# EAGLE schematic 11-de-7 (EAGLE 6.6.0)
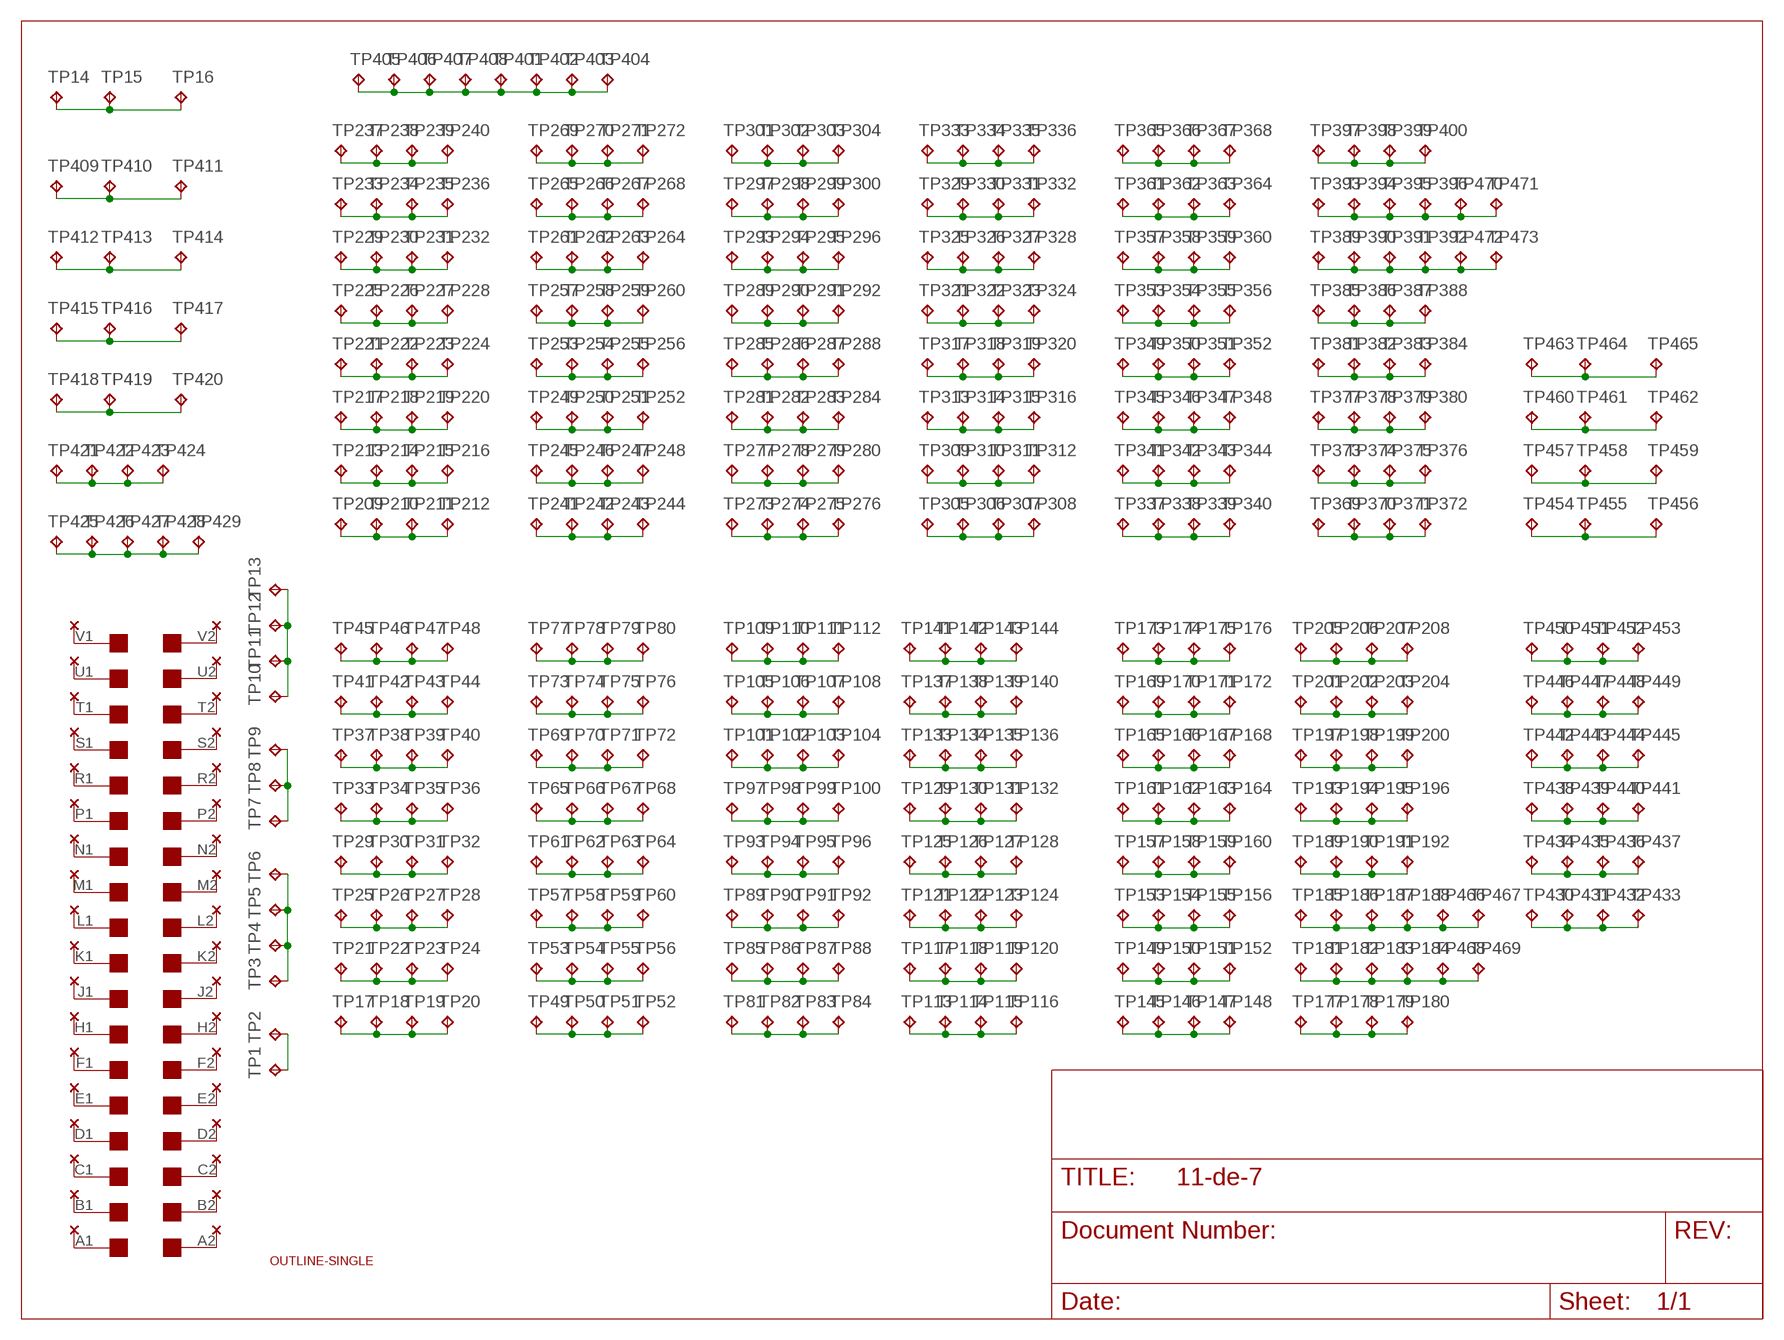
[diagram p0: schematic, sheet 1]

## Parts
TP1  TPPAD1-13Y  [P1-13Y]
TP2  TPPAD1-13  [P1-13]
TP3  TPPAD1-13Y  [P1-13Y]
TP4  TPPAD1-13Y  [P1-13Y]
TP5  TPPAD1-13Y  [P1-13Y]
TP6  TPPAD1-13Y  [P1-13Y]
TP7  TPPAD1-13Y  [P1-13Y]
TP8  TPPAD1-13Y  [P1-13Y]
TP9  TPPAD1-13Y  [P1-13Y]
TP10  TPPAD1-13Y  [P1-13Y]
TP11  TPPAD1-13Y  [P1-13Y]
TP12  TPPAD1-13Y  [P1-13Y]
TP13  TPPAD1-13Y  [P1-13Y]
TP14  TPPAD1-13Y  [P1-13Y]
TP15  TPPAD1-13Y  [P1-13Y]
TP16  TPPAD1-13Y  [P1-13Y]
TP17  TPPAD1-13Y  [P1-13Y]
TP18  TPPAD1-13Y  [P1-13Y]
TP19  TPPAD1-13Y  [P1-13Y]
TP20  TPPAD1-13Y  [P1-13Y]
TP21  TPPAD1-13Y  [P1-13Y]
TP22  TPPAD1-13Y  [P1-13Y]
TP23  TPPAD1-13Y  [P1-13Y]
TP24  TPPAD1-13Y  [P1-13Y]
TP25  TPPAD1-13Y  [P1-13Y]
TP26  TPPAD1-13Y  [P1-13Y]
TP27  TPPAD1-13Y  [P1-13Y]
TP28  TPPAD1-13Y  [P1-13Y]
TP29  TPPAD1-13Y  [P1-13Y]
TP30  TPPAD1-13Y  [P1-13Y]
TP31  TPPAD1-13Y  [P1-13Y]
TP32  TPPAD1-13Y  [P1-13Y]
TP33  TPPAD1-13Y  [P1-13Y]
TP34  TPPAD1-13Y  [P1-13Y]
TP35  TPPAD1-13Y  [P1-13Y]
TP36  TPPAD1-13Y  [P1-13Y]
TP37  TPPAD1-13Y  [P1-13Y]
TP38  TPPAD1-13Y  [P1-13Y]
TP39  TPPAD1-13Y  [P1-13Y]
TP40  TPPAD1-13Y  [P1-13Y]
TP41  TPPAD1-13Y  [P1-13Y]
TP42  TPPAD1-13Y  [P1-13Y]
TP43  TPPAD1-13Y  [P1-13Y]
TP44  TPPAD1-13Y  [P1-13Y]
TP45  TPPAD1-13Y  [P1-13Y]
TP46  TPPAD1-13Y  [P1-13Y]
TP47  TPPAD1-13Y  [P1-13Y]
TP48  TPPAD1-13Y  [P1-13Y]
TP49  TPPAD1-13Y  [P1-13Y]
TP50  TPPAD1-13Y  [P1-13Y]
TP51  TPPAD1-13Y  [P1-13Y]
TP52  TPPAD1-13Y  [P1-13Y]
TP53  TPPAD1-13Y  [P1-13Y]
TP54  TPPAD1-13Y  [P1-13Y]
TP55  TPPAD1-13Y  [P1-13Y]
TP56  TPPAD1-13Y  [P1-13Y]
TP57  TPPAD1-13Y  [P1-13Y]
TP58  TPPAD1-13Y  [P1-13Y]
TP59  TPPAD1-13Y  [P1-13Y]
TP60  TPPAD1-13Y  [P1-13Y]
TP61  TPPAD1-13Y  [P1-13Y]
TP62  TPPAD1-13Y  [P1-13Y]
TP63  TPPAD1-13Y  [P1-13Y]
TP64  TPPAD1-13Y  [P1-13Y]
TP65  TPPAD1-13Y  [P1-13Y]
TP66  TPPAD1-13Y  [P1-13Y]
TP67  TPPAD1-13Y  [P1-13Y]
TP68  TPPAD1-13Y  [P1-13Y]
TP69  TPPAD1-13Y  [P1-13Y]
TP70  TPPAD1-13Y  [P1-13Y]
TP71  TPPAD1-13Y  [P1-13Y]
TP72  TPPAD1-13Y  [P1-13Y]
TP73  TPPAD1-13Y  [P1-13Y]
TP74  TPPAD1-13Y  [P1-13Y]
TP75  TPPAD1-13Y  [P1-13Y]
TP76  TPPAD1-13Y  [P1-13Y]
TP77  TPPAD1-13Y  [P1-13Y]
TP78  TPPAD1-13Y  [P1-13Y]
TP79  TPPAD1-13Y  [P1-13Y]
TP80  TPPAD1-13Y  [P1-13Y]
TP81  TPPAD1-13Y  [P1-13Y]
TP82  TPPAD1-13Y  [P1-13Y]
TP83  TPPAD1-13Y  [P1-13Y]
TP84  TPPAD1-13Y  [P1-13Y]
TP85  TPPAD1-13Y  [P1-13Y]
TP86  TPPAD1-13Y  [P1-13Y]
TP87  TPPAD1-13Y  [P1-13Y]
TP88  TPPAD1-13Y  [P1-13Y]
TP89  TPPAD1-13Y  [P1-13Y]
TP90  TPPAD1-13Y  [P1-13Y]
TP91  TPPAD1-13Y  [P1-13Y]
TP92  TPPAD1-13Y  [P1-13Y]
TP93  TPPAD1-13Y  [P1-13Y]
TP94  TPPAD1-13Y  [P1-13Y]
TP95  TPPAD1-13Y  [P1-13Y]
TP96  TPPAD1-13Y  [P1-13Y]
TP97  TPPAD1-13Y  [P1-13Y]
TP98  TPPAD1-13Y  [P1-13Y]
TP99  TPPAD1-13Y  [P1-13Y]
TP100  TPPAD1-13Y  [P1-13Y]
TP101  TPPAD1-13Y  [P1-13Y]
TP102  TPPAD1-13Y  [P1-13Y]
TP103  TPPAD1-13Y  [P1-13Y]
TP104  TPPAD1-13Y  [P1-13Y]
TP105  TPPAD1-13Y  [P1-13Y]
TP106  TPPAD1-13Y  [P1-13Y]
TP107  TPPAD1-13Y  [P1-13Y]
TP108  TPPAD1-13Y  [P1-13Y]
TP109  TPPAD1-13Y  [P1-13Y]
TP110  TPPAD1-13Y  [P1-13Y]
TP111  TPPAD1-13Y  [P1-13Y]
TP112  TPPAD1-13Y  [P1-13Y]
TP113  TPPAD1-13Y  [P1-13Y]
TP114  TPPAD1-13Y  [P1-13Y]
TP115  TPPAD1-13Y  [P1-13Y]
TP116  TPPAD1-13Y  [P1-13Y]
TP117  TPPAD1-13Y  [P1-13Y]
TP118  TPPAD1-13Y  [P1-13Y]
TP119  TPPAD1-13Y  [P1-13Y]
TP120  TPPAD1-13Y  [P1-13Y]
TP121  TPPAD1-13Y  [P1-13Y]
TP122  TPPAD1-13Y  [P1-13Y]
TP123  TPPAD1-13Y  [P1-13Y]
TP124  TPPAD1-13Y  [P1-13Y]
TP125  TPPAD1-13Y  [P1-13Y]
TP126  TPPAD1-13Y  [P1-13Y]
TP127  TPPAD1-13Y  [P1-13Y]
TP128  TPPAD1-13Y  [P1-13Y]
TP129  TPPAD1-13Y  [P1-13Y]
TP130  TPPAD1-13Y  [P1-13Y]
TP131  TPPAD1-13Y  [P1-13Y]
TP132  TPPAD1-13Y  [P1-13Y]
TP133  TPPAD1-13Y  [P1-13Y]
TP134  TPPAD1-13Y  [P1-13Y]
TP135  TPPAD1-13Y  [P1-13Y]
TP136  TPPAD1-13Y  [P1-13Y]
TP137  TPPAD1-13Y  [P1-13Y]
TP138  TPPAD1-13Y  [P1-13Y]
TP139  TPPAD1-13Y  [P1-13Y]
TP140  TPPAD1-13Y  [P1-13Y]
TP141  TPPAD1-13Y  [P1-13Y]
TP142  TPPAD1-13Y  [P1-13Y]
TP143  TPPAD1-13Y  [P1-13Y]
TP144  TPPAD1-13Y  [P1-13Y]
TP145  TPPAD1-13Y  [P1-13Y]
TP146  TPPAD1-13Y  [P1-13Y]
TP147  TPPAD1-13Y  [P1-13Y]
TP148  TPPAD1-13Y  [P1-13Y]
TP149  TPPAD1-13Y  [P1-13Y]
TP150  TPPAD1-13Y  [P1-13Y]
TP151  TPPAD1-13Y  [P1-13Y]
TP152  TPPAD1-13Y  [P1-13Y]
TP153  TPPAD1-13Y  [P1-13Y]
TP154  TPPAD1-13Y  [P1-13Y]
TP155  TPPAD1-13Y  [P1-13Y]
TP156  TPPAD1-13Y  [P1-13Y]
TP157  TPPAD1-13Y  [P1-13Y]
TP158  TPPAD1-13Y  [P1-13Y]
TP159  TPPAD1-13Y  [P1-13Y]
TP160  TPPAD1-13Y  [P1-13Y]
TP161  TPPAD1-13Y  [P1-13Y]
TP162  TPPAD1-13Y  [P1-13Y]
TP163  TPPAD1-13Y  [P1-13Y]
TP164  TPPAD1-13Y  [P1-13Y]
TP165  TPPAD1-13Y  [P1-13Y]
TP166  TPPAD1-13Y  [P1-13Y]
TP167  TPPAD1-13Y  [P1-13Y]
TP168  TPPAD1-13Y  [P1-13Y]
TP169  TPPAD1-13Y  [P1-13Y]
TP170  TPPAD1-13Y  [P1-13Y]
TP171  TPPAD1-13Y  [P1-13Y]
TP172  TPPAD1-13Y  [P1-13Y]
TP173  TPPAD1-13Y  [P1-13Y]
TP174  TPPAD1-13Y  [P1-13Y]
TP175  TPPAD1-13Y  [P1-13Y]
TP176  TPPAD1-13Y  [P1-13Y]
TP177  TPPAD1-13Y  [P1-13Y]
TP178  TPPAD1-13Y  [P1-13Y]
TP179  TPPAD1-13Y  [P1-13Y]
TP180  TPPAD1-13Y  [P1-13Y]
TP181  TPPAD1-13Y  [P1-13Y]
TP182  TPPAD1-13Y  [P1-13Y]
TP183  TPPAD1-13Y  [P1-13Y]
TP184  TPPAD1-13Y  [P1-13Y]
TP185  TPPAD1-13Y  [P1-13Y]
TP186  TPPAD1-13Y  [P1-13Y]
TP187  TPPAD1-13Y  [P1-13Y]
TP188  TPPAD1-13Y  [P1-13Y]
TP189  TPPAD1-13Y  [P1-13Y]
TP190  TPPAD1-13Y  [P1-13Y]
TP191  TPPAD1-13Y  [P1-13Y]
TP192  TPPAD1-13Y  [P1-13Y]
TP193  TPPAD1-13Y  [P1-13Y]
TP194  TPPAD1-13Y  [P1-13Y]
TP195  TPPAD1-13Y  [P1-13Y]
TP196  TPPAD1-13Y  [P1-13Y]
TP197  TPPAD1-13Y  [P1-13Y]
TP198  TPPAD1-13Y  [P1-13Y]
TP199  TPPAD1-13Y  [P1-13Y]
TP200  TPPAD1-13Y  [P1-13Y]
TP201  TPPAD1-13Y  [P1-13Y]
TP202  TPPAD1-13Y  [P1-13Y]
TP203  TPPAD1-13Y  [P1-13Y]
TP204  TPPAD1-13Y  [P1-13Y]
TP205  TPPAD1-13Y  [P1-13Y]
TP206  TPPAD1-13Y  [P1-13Y]
TP207  TPPAD1-13Y  [P1-13Y]
TP208  TPPAD1-13Y  [P1-13Y]
TP209  TPPAD1-13Y  [P1-13Y]
TP210  TPPAD1-13Y  [P1-13Y]
TP211  TPPAD1-13Y  [P1-13Y]
TP212  TPPAD1-13Y  [P1-13Y]
TP213  TPPAD1-13Y  [P1-13Y]
TP214  TPPAD1-13Y  [P1-13Y]
TP215  TPPAD1-13Y  [P1-13Y]
TP216  TPPAD1-13Y  [P1-13Y]
TP217  TPPAD1-13Y  [P1-13Y]
TP218  TPPAD1-13Y  [P1-13Y]
TP219  TPPAD1-13Y  [P1-13Y]
TP220  TPPAD1-13Y  [P1-13Y]
TP221  TPPAD1-13Y  [P1-13Y]
TP222  TPPAD1-13Y  [P1-13Y]
TP223  TPPAD1-13Y  [P1-13Y]
TP224  TPPAD1-13Y  [P1-13Y]
TP225  TPPAD1-13Y  [P1-13Y]
TP226  TPPAD1-13Y  [P1-13Y]
TP227  TPPAD1-13Y  [P1-13Y]
TP228  TPPAD1-13Y  [P1-13Y]
TP229  TPPAD1-13Y  [P1-13Y]
TP230  TPPAD1-13Y  [P1-13Y]
TP231  TPPAD1-13Y  [P1-13Y]
TP232  TPPAD1-13Y  [P1-13Y]
TP233  TPPAD1-13Y  [P1-13Y]
TP234  TPPAD1-13Y  [P1-13Y]
TP235  TPPAD1-13Y  [P1-13Y]
TP236  TPPAD1-13Y  [P1-13Y]
TP237  TPPAD1-13Y  [P1-13Y]
TP238  TPPAD1-13Y  [P1-13Y]
TP239  TPPAD1-13Y  [P1-13Y]
TP240  TPPAD1-13Y  [P1-13Y]
TP241  TPPAD1-13Y  [P1-13Y]
TP242  TPPAD1-13Y  [P1-13Y]
TP243  TPPAD1-13Y  [P1-13Y]
TP244  TPPAD1-13Y  [P1-13Y]
TP245  TPPAD1-13Y  [P1-13Y]
TP246  TPPAD1-13Y  [P1-13Y]
TP247  TPPAD1-13Y  [P1-13Y]
TP248  TPPAD1-13Y  [P1-13Y]
TP249  TPPAD1-13Y  [P1-13Y]
TP250  TPPAD1-13Y  [P1-13Y]
TP251  TPPAD1-13Y  [P1-13Y]
TP252  TPPAD1-13Y  [P1-13Y]
TP253  TPPAD1-13Y  [P1-13Y]
TP254  TPPAD1-13Y  [P1-13Y]
TP255  TPPAD1-13Y  [P1-13Y]
TP256  TPPAD1-13Y  [P1-13Y]
TP257  TPPAD1-13Y  [P1-13Y]
TP258  TPPAD1-13Y  [P1-13Y]
TP259  TPPAD1-13Y  [P1-13Y]
TP260  TPPAD1-13Y  [P1-13Y]
TP261  TPPAD1-13Y  [P1-13Y]
TP262  TPPAD1-13Y  [P1-13Y]
TP263  TPPAD1-13Y  [P1-13Y]
TP264  TPPAD1-13Y  [P1-13Y]
TP265  TPPAD1-13Y  [P1-13Y]
TP266  TPPAD1-13Y  [P1-13Y]
TP267  TPPAD1-13Y  [P1-13Y]
TP268  TPPAD1-13Y  [P1-13Y]
TP269  TPPAD1-13Y  [P1-13Y]
TP270  TPPAD1-13Y  [P1-13Y]
TP271  TPPAD1-13Y  [P1-13Y]
TP272  TPPAD1-13Y  [P1-13Y]
TP273  TPPAD1-13Y  [P1-13Y]
TP274  TPPAD1-13Y  [P1-13Y]
TP275  TPPAD1-13Y  [P1-13Y]
TP276  TPPAD1-13Y  [P1-13Y]
TP277  TPPAD1-13Y  [P1-13Y]
TP278  TPPAD1-13Y  [P1-13Y]
TP279  TPPAD1-13Y  [P1-13Y]
TP280  TPPAD1-13Y  [P1-13Y]
TP281  TPPAD1-13Y  [P1-13Y]
TP282  TPPAD1-13Y  [P1-13Y]
TP283  TPPAD1-13Y  [P1-13Y]
TP284  TPPAD1-13Y  [P1-13Y]
TP285  TPPAD1-13Y  [P1-13Y]
TP286  TPPAD1-13Y  [P1-13Y]
TP287  TPPAD1-13Y  [P1-13Y]
TP288  TPPAD1-13Y  [P1-13Y]
TP289  TPPAD1-13Y  [P1-13Y]
TP290  TPPAD1-13Y  [P1-13Y]
TP291  TPPAD1-13Y  [P1-13Y]
TP292  TPPAD1-13Y  [P1-13Y]
TP293  TPPAD1-13Y  [P1-13Y]
TP294  TPPAD1-13Y  [P1-13Y]
TP295  TPPAD1-13Y  [P1-13Y]
TP296  TPPAD1-13Y  [P1-13Y]
TP297  TPPAD1-13Y  [P1-13Y]
TP298  TPPAD1-13Y  [P1-13Y]
TP299  TPPAD1-13Y  [P1-13Y]
TP300  TPPAD1-13Y  [P1-13Y]
TP301  TPPAD1-13Y  [P1-13Y]
TP302  TPPAD1-13Y  [P1-13Y]
TP303  TPPAD1-13Y  [P1-13Y]
TP304  TPPAD1-13Y  [P1-13Y]
TP305  TPPAD1-13Y  [P1-13Y]
TP306  TPPAD1-13Y  [P1-13Y]
TP307  TPPAD1-13Y  [P1-13Y]
TP308  TPPAD1-13Y  [P1-13Y]
TP309  TPPAD1-13Y  [P1-13Y]
TP310  TPPAD1-13Y  [P1-13Y]
TP311  TPPAD1-13Y  [P1-13Y]
TP312  TPPAD1-13Y  [P1-13Y]
TP313  TPPAD1-13Y  [P1-13Y]
TP314  TPPAD1-13Y  [P1-13Y]
TP315  TPPAD1-13Y  [P1-13Y]
TP316  TPPAD1-13Y  [P1-13Y]
TP317  TPPAD1-13Y  [P1-13Y]
TP318  TPPAD1-13Y  [P1-13Y]
TP319  TPPAD1-13Y  [P1-13Y]
TP320  TPPAD1-13Y  [P1-13Y]
TP321  TPPAD1-13Y  [P1-13Y]
TP322  TPPAD1-13Y  [P1-13Y]
TP323  TPPAD1-13Y  [P1-13Y]
TP324  TPPAD1-13Y  [P1-13Y]
TP325  TPPAD1-13Y  [P1-13Y]
TP326  TPPAD1-13Y  [P1-13Y]
TP327  TPPAD1-13Y  [P1-13Y]
TP328  TPPAD1-13Y  [P1-13Y]
TP329  TPPAD1-13Y  [P1-13Y]
TP330  TPPAD1-13Y  [P1-13Y]
TP331  TPPAD1-13Y  [P1-13Y]
TP332  TPPAD1-13Y  [P1-13Y]
TP333  TPPAD1-13Y  [P1-13Y]
TP334  TPPAD1-13Y  [P1-13Y]
TP335  TPPAD1-13Y  [P1-13Y]
TP336  TPPAD1-13Y  [P1-13Y]
TP337  TPPAD1-13Y  [P1-13Y]
TP338  TPPAD1-13Y  [P1-13Y]
TP339  TPPAD1-13Y  [P1-13Y]
TP340  TPPAD1-13Y  [P1-13Y]
TP341  TPPAD1-13Y  [P1-13Y]
TP342  TPPAD1-13Y  [P1-13Y]
TP343  TPPAD1-13Y  [P1-13Y]
TP344  TPPAD1-13Y  [P1-13Y]
TP345  TPPAD1-13Y  [P1-13Y]
TP346  TPPAD1-13Y  [P1-13Y]
TP347  TPPAD1-13Y  [P1-13Y]
TP348  TPPAD1-13Y  [P1-13Y]
TP349  TPPAD1-13Y  [P1-13Y]
TP350  TPPAD1-13Y  [P1-13Y]
TP351  TPPAD1-13Y  [P1-13Y]
TP352  TPPAD1-13Y  [P1-13Y]
TP353  TPPAD1-13Y  [P1-13Y]
TP354  TPPAD1-13Y  [P1-13Y]
TP355  TPPAD1-13Y  [P1-13Y]
TP356  TPPAD1-13Y  [P1-13Y]
TP357  TPPAD1-13Y  [P1-13Y]
TP358  TPPAD1-13Y  [P1-13Y]
TP359  TPPAD1-13Y  [P1-13Y]
TP360  TPPAD1-13Y  [P1-13Y]
TP361  TPPAD1-13Y  [P1-13Y]
TP362  TPPAD1-13Y  [P1-13Y]
TP363  TPPAD1-13Y  [P1-13Y]
TP364  TPPAD1-13Y  [P1-13Y]
TP365  TPPAD1-13Y  [P1-13Y]
TP366  TPPAD1-13Y  [P1-13Y]
TP367  TPPAD1-13Y  [P1-13Y]
TP368  TPPAD1-13Y  [P1-13Y]
TP369  TPPAD1-13Y  [P1-13Y]
TP370  TPPAD1-13Y  [P1-13Y]
TP371  TPPAD1-13Y  [P1-13Y]
TP372  TPPAD1-13Y  [P1-13Y]
TP373  TPPAD1-13Y  [P1-13Y]
TP374  TPPAD1-13Y  [P1-13Y]
TP375  TPPAD1-13Y  [P1-13Y]
TP376  TPPAD1-13Y  [P1-13Y]
TP377  TPPAD1-13Y  [P1-13Y]
TP378  TPPAD1-13Y  [P1-13Y]
TP379  TPPAD1-13Y  [P1-13Y]
TP380  TPPAD1-13Y  [P1-13Y]
TP381  TPPAD1-13Y  [P1-13Y]
TP382  TPPAD1-13Y  [P1-13Y]
TP383  TPPAD1-13Y  [P1-13Y]
TP384  TPPAD1-13Y  [P1-13Y]
TP385  TPPAD1-13Y  [P1-13Y]
TP386  TPPAD1-13Y  [P1-13Y]
TP387  TPPAD1-13Y  [P1-13Y]
TP388  TPPAD1-13Y  [P1-13Y]
TP389  TPPAD1-13Y  [P1-13Y]
TP390  TPPAD1-13Y  [P1-13Y]
TP391  TPPAD1-13Y  [P1-13Y]
TP392  TPPAD1-13Y  [P1-13Y]
TP393  TPPAD1-13Y  [P1-13Y]
TP394  TPPAD1-13Y  [P1-13Y]
TP395  TPPAD1-13Y  [P1-13Y]
TP396  TPPAD1-13Y  [P1-13Y]
TP397  TPPAD1-13Y  [P1-13Y]
TP398  TPPAD1-13Y  [P1-13Y]
TP399  TPPAD1-13Y  [P1-13Y]
TP400  TPPAD1-13Y  [P1-13Y]
TP401  TPPAD1-13Y  [P1-13Y]
TP402  TPPAD1-13Y  [P1-13Y]
TP403  TPPAD1-13Y  [P1-13Y]
TP404  TPPAD1-13Y  [P1-13Y]
TP405  TPPAD1-13Y  [P1-13Y]
TP406  TPPAD1-13Y  [P1-13Y]
TP407  TPPAD1-13Y  [P1-13Y]
TP408  TPPAD1-13Y  [P1-13Y]
TP409  TPPAD1-13Y  [P1-13Y]
TP410  TPPAD1-13Y  [P1-13Y]
TP411  TPPAD1-13Y  [P1-13Y]
TP412  TPPAD1-13Y  [P1-13Y]
TP413  TPPAD1-13Y  [P1-13Y]
TP414  TPPAD1-13Y  [P1-13Y]
TP415  TPPAD1-13Y  [P1-13Y]
TP416  TPPAD1-13Y  [P1-13Y]
TP417  TPPAD1-13Y  [P1-13Y]
TP418  TPPAD1-13Y  [P1-13Y]
TP419  TPPAD1-13Y  [P1-13Y]
TP420  TPPAD1-13Y  [P1-13Y]
TP421  TPPAD1-13Y  [P1-13Y]
TP422  TPPAD1-13Y  [P1-13Y]
TP423  TPPAD1-13Y  [P1-13Y]
TP424  TPPAD1-13Y  [P1-13Y]
TP425  TPPAD1-13Y  [P1-13Y]
TP426  TPPAD1-13Y  [P1-13Y]
TP427  TPPAD1-13Y  [P1-13Y]
TP428  TPPAD1-13Y  [P1-13Y]
TP429  TPPAD1-13Y  [P1-13Y]
TP430  TPPAD1-13Y  [P1-13Y]
TP431  TPPAD1-13Y  [P1-13Y]
TP432  TPPAD1-13Y  [P1-13Y]
TP433  TPPAD1-13Y  [P1-13Y]
TP434  TPPAD1-13Y  [P1-13Y]
TP435  TPPAD1-13Y  [P1-13Y]
TP436  TPPAD1-13Y  [P1-13Y]
TP437  TPPAD1-13Y  [P1-13Y]
TP438  TPPAD1-13Y  [P1-13Y]
TP439  TPPAD1-13Y  [P1-13Y]
TP440  TPPAD1-13Y  [P1-13Y]
TP441  TPPAD1-13Y  [P1-13Y]
TP442  TPPAD1-13Y  [P1-13Y]
TP443  TPPAD1-13Y  [P1-13Y]
TP444  TPPAD1-13Y  [P1-13Y]
TP445  TPPAD1-13Y  [P1-13Y]
TP446  TPPAD1-13Y  [P1-13Y]
TP447  TPPAD1-13Y  [P1-13Y]
TP448  TPPAD1-13Y  [P1-13Y]
TP449  TPPAD1-13Y  [P1-13Y]
TP450  TPPAD1-13Y  [P1-13Y]
TP451  TPPAD1-13Y  [P1-13Y]
TP452  TPPAD1-13Y  [P1-13Y]
TP453  TPPAD1-13Y  [P1-13Y]
TP454  TPPAD1-13Y  [P1-13Y]
TP455  TPPAD1-13Y  [P1-13Y]
TP456  TPPAD1-13Y  [P1-13Y]
TP457  TPPAD1-13Y  [P1-13Y]
TP458  TPPAD1-13Y  [P1-13Y]
TP459  TPPAD1-13Y  [P1-13Y]
TP460  TPPAD1-13Y  [P1-13Y]
TP461  TPPAD1-13Y  [P1-13Y]
TP462  TPPAD1-13Y  [P1-13Y]
TP463  TPPAD1-13Y  [P1-13Y]
TP464  TPPAD1-13Y  [P1-13Y]
TP465  TPPAD1-13Y  [P1-13Y]
TP466  TPPAD1-13Y  [P1-13Y]
TP467  TPPAD1-13Y  [P1-13Y]
TP468  TPPAD1-13Y  [P1-13Y]
TP469  TPPAD1-13Y  [P1-13Y]
TP470  TPPAD1-13Y  [P1-13Y]
TP471  TPPAD1-13Y  [P1-13Y]
TP472  TPPAD1-13Y  [P1-13Y]
TP473  TPPAD1-13Y  [P1-13Y]
U$1  SINGLE  [EDGE-CON2]
U$3  OUTLINE-SINGLE  [SINGLE]
U$5  THRU-HOLE2C  [THRU-HOLEC]

## Nets
N$1: U$1.L2 U$5.L2
N$2: U$1.M2 U$5.M2
N$3: U$1.N2 U$5.N2
N$4: U$1.K2 U$5.K2
N$5: U$1.J2 U$5.J2
N$6: U$1.H2 U$5.H2
N$7: U$1.F2 U$5.F2
N$8: U$1.P2 U$5.P2
N$9: U$1.R2 U$5.R2
N$10: U$1.S2 U$5.S2
N$11: U$1.T2 U$5.T2
N$12: U$1.E2 U$5.E2
N$13: U$1.D2 U$5.D2
N$14: U$1.U2 U$5.U2
N$15: U$1.V2 U$5.V2
N$16: U$1.C2 U$5.C2
N$17: U$1.B2 U$5.B2
N$18: U$1.A2 U$5.A2
N$19: U$1.V1 U$5.V1
N$20: U$1.A1 U$5.A1
N$21: U$1.B1 U$5.B1
N$22: U$1.C1 U$5.C1
N$23: U$1.D1 U$5.D1
N$24: U$1.E1 U$5.E1
N$25: U$1.F1 U$5.F1
N$26: U$1.H1 U$5.H1
N$27: U$1.J1 U$5.J1
N$28: U$1.K1 U$5.K1
N$29: U$1.L1 U$5.L1
N$30: U$1.M1 U$5.M1
N$31: U$1.N1 U$5.N1
N$32: U$1.P1 U$5.P1
N$33: U$1.R1 U$5.R1
N$34: U$1.S1 U$5.S1
N$35: U$1.T1 U$5.T1
N$36: U$1.U1 U$5.U1
N$37: TP1.TP TP2.TP
N$38: TP3.TP TP4.TP TP5.TP TP6.TP
N$39: TP10.TP TP11.TP TP12.TP TP13.TP
N$40: TP7.TP TP8.TP TP9.TP
N$41: TP14.TP TP15.TP TP16.TP
N$42: TP17.TP TP18.TP TP19.TP TP20.TP
N$43: TP21.TP TP22.TP TP23.TP TP24.TP
N$44: TP25.TP TP26.TP TP27.TP TP28.TP
N$45: TP29.TP TP30.TP TP31.TP TP32.TP
N$46: TP33.TP TP34.TP TP35.TP TP36.TP
N$47: TP37.TP TP38.TP TP39.TP TP40.TP
N$48: TP41.TP TP42.TP TP43.TP TP44.TP
N$49: TP45.TP TP46.TP TP47.TP TP48.TP
N$50: TP49.TP TP50.TP TP51.TP TP52.TP
N$51: TP53.TP TP54.TP TP55.TP TP56.TP
N$52: TP57.TP TP58.TP TP59.TP TP60.TP
N$53: TP61.TP TP62.TP TP63.TP TP64.TP
N$54: TP65.TP TP66.TP TP67.TP TP68.TP
N$55: TP69.TP TP70.TP TP71.TP TP72.TP
N$56: TP73.TP TP74.TP TP75.TP TP76.TP
N$57: TP77.TP TP78.TP TP79.TP TP80.TP
N$58: TP81.TP TP82.TP TP83.TP TP84.TP
N$59: TP85.TP TP86.TP TP87.TP TP88.TP
N$60: TP89.TP TP90.TP TP91.TP TP92.TP
N$61: TP93.TP TP94.TP TP95.TP TP96.TP
N$62: TP97.TP TP98.TP TP99.TP TP100.TP
N$63: TP101.TP TP102.TP TP103.TP TP104.TP
N$64: TP105.TP TP106.TP TP107.TP TP108.TP
N$65: TP109.TP TP110.TP TP111.TP TP112.TP
N$66: TP113.TP TP114.TP TP115.TP TP116.TP
N$67: TP117.TP TP118.TP TP119.TP TP120.TP
N$68: TP121.TP TP122.TP TP123.TP TP124.TP
N$69: TP125.TP TP126.TP TP127.TP TP128.TP
N$70: TP129.TP TP130.TP TP131.TP TP132.TP
N$71: TP133.TP TP134.TP TP135.TP TP136.TP
N$72: TP137.TP TP138.TP TP139.TP TP140.TP
N$73: TP141.TP TP142.TP TP143.TP TP144.TP
N$74: TP145.TP TP146.TP TP147.TP TP148.TP
N$75: TP149.TP TP150.TP TP151.TP TP152.TP
N$76: TP153.TP TP154.TP TP155.TP TP156.TP
N$77: TP157.TP TP158.TP TP159.TP TP160.TP
N$78: TP161.TP TP162.TP TP163.TP TP164.TP
N$79: TP165.TP TP166.TP TP167.TP TP168.TP
N$80: TP169.TP TP170.TP TP171.TP TP172.TP
N$81: TP173.TP TP174.TP TP175.TP TP176.TP
N$82: TP177.TP TP178.TP TP179.TP TP180.TP
N$83: TP181.TP TP182.TP TP183.TP TP184.TP TP468.TP TP469.TP
N$84: TP185.TP TP186.TP TP187.TP TP188.TP TP466.TP TP467.TP
N$85: TP189.TP TP190.TP TP191.TP TP192.TP
N$86: TP193.TP TP194.TP TP195.TP TP196.TP
N$87: TP197.TP TP198.TP TP199.TP TP200.TP
N$88: TP201.TP TP202.TP TP203.TP TP204.TP
N$89: TP205.TP TP206.TP TP207.TP TP208.TP
N$90: TP209.TP TP210.TP TP211.TP TP212.TP
N$91: TP213.TP TP214.TP TP215.TP TP216.TP
N$92: TP217.TP TP218.TP TP219.TP TP220.TP
N$93: TP221.TP TP222.TP TP223.TP TP224.TP
N$94: TP225.TP TP226.TP TP227.TP TP228.TP
N$95: TP229.TP TP230.TP TP231.TP TP232.TP
N$96: TP233.TP TP234.TP TP235.TP TP236.TP
N$97: TP237.TP TP238.TP TP239.TP TP240.TP
N$98: TP241.TP TP242.TP TP243.TP TP244.TP
N$99: TP245.TP TP246.TP TP247.TP TP248.TP
N$100: TP249.TP TP250.TP TP251.TP TP252.TP
N$101: TP253.TP TP254.TP TP255.TP TP256.TP
N$102: TP257.TP TP258.TP TP259.TP TP260.TP
N$103: TP261.TP TP262.TP TP263.TP TP264.TP
N$104: TP265.TP TP266.TP TP267.TP TP268.TP
N$105: TP269.TP TP270.TP TP271.TP TP272.TP
N$106: TP273.TP TP274.TP TP275.TP TP276.TP
N$107: TP277.TP TP278.TP TP279.TP TP280.TP
N$108: TP281.TP TP282.TP TP283.TP TP284.TP
N$109: TP285.TP TP286.TP TP287.TP TP288.TP
N$110: TP289.TP TP290.TP TP291.TP TP292.TP
N$111: TP293.TP TP294.TP TP295.TP TP296.TP
N$112: TP297.TP TP298.TP TP299.TP TP300.TP
N$113: TP301.TP TP302.TP TP303.TP TP304.TP
N$114: TP305.TP TP306.TP TP307.TP TP308.TP
N$115: TP309.TP TP310.TP TP311.TP TP312.TP
N$116: TP313.TP TP314.TP TP315.TP TP316.TP
N$117: TP317.TP TP318.TP TP319.TP TP320.TP
N$118: TP321.TP TP322.TP TP323.TP TP324.TP
N$119: TP325.TP TP326.TP TP327.TP TP328.TP
N$120: TP329.TP TP330.TP TP331.TP TP332.TP
N$121: TP333.TP TP334.TP TP335.TP TP336.TP
N$122: TP337.TP TP338.TP TP339.TP TP340.TP
N$123: TP341.TP TP342.TP TP343.TP TP344.TP
N$124: TP345.TP TP346.TP TP347.TP TP348.TP
N$125: TP349.TP TP350.TP TP351.TP TP352.TP
N$126: TP353.TP TP354.TP TP355.TP TP356.TP
N$127: TP357.TP TP358.TP TP359.TP TP360.TP
N$128: TP361.TP TP362.TP TP363.TP TP364.TP
N$129: TP365.TP TP366.TP TP367.TP TP368.TP
N$130: TP369.TP TP370.TP TP371.TP TP372.TP
N$131: TP373.TP TP374.TP TP375.TP TP376.TP
N$132: TP377.TP TP378.TP TP379.TP TP380.TP
N$133: TP381.TP TP382.TP TP383.TP TP384.TP
N$134: TP385.TP TP386.TP TP387.TP TP388.TP
N$135: TP389.TP TP390.TP TP391.TP TP392.TP TP472.TP TP473.TP
N$136: TP393.TP TP394.TP TP395.TP TP396.TP TP470.TP TP471.TP
N$137: TP397.TP TP398.TP TP399.TP TP400.TP
N$138: TP401.TP TP402.TP TP403.TP TP404.TP TP405.TP TP406.TP TP407.TP TP408.TP
N$139: TP430.TP TP431.TP TP432.TP TP433.TP
N$140: TP434.TP TP435.TP TP436.TP TP437.TP
N$141: TP438.TP TP439.TP TP440.TP TP441.TP
N$142: TP442.TP TP443.TP TP444.TP TP445.TP
N$143: TP409.TP TP410.TP TP411.TP
N$144: TP412.TP TP413.TP TP414.TP
N$145: TP415.TP TP416.TP TP417.TP
N$146: TP418.TP TP419.TP TP420.TP
N$147: TP421.TP TP422.TP TP423.TP TP424.TP
N$148: TP425.TP TP426.TP TP427.TP TP428.TP TP429.TP
N$149: TP446.TP TP447.TP TP448.TP TP449.TP
N$150: TP450.TP TP451.TP TP452.TP TP453.TP
N$151: TP454.TP TP455.TP TP456.TP
N$152: TP457.TP TP458.TP TP459.TP
N$153: TP460.TP TP461.TP TP462.TP
N$154: TP463.TP TP464.TP TP465.TP

## Library data of the parts
TP1-TP473 = testpad:TP: Test pad
U$1 = dec-con:SINGLE: Single-Height DEC board
U$3 = dec-con:OUTLINE-*: Board outlines for DEC boards.
U$5 = dec-con:THRU-HOLE2: Thru-Hole addition to double-sided edge connector.

## Net classes
0 default: width 1.143 mm